# Altium schematic sheet 04_AD623.SchDoc
size A4
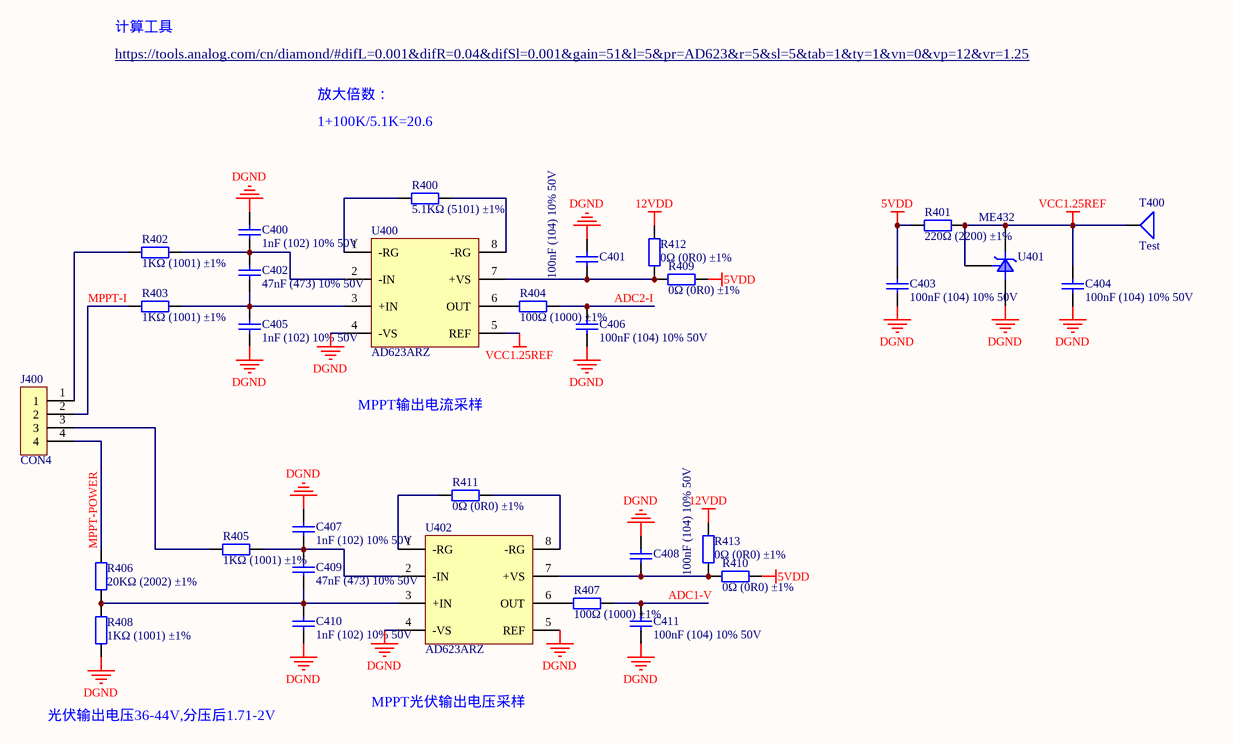
[diagram p0: 04_AD623.SchDoc]

## Parts
C400  1nF (102) 10% 50V  [0603_C]
C401  100nF (104) 10% 50V  [0603_C]
C402  47nF (473) 10% 50V  [0603_C]
C403  100nF (104) 10% 50V  [0603_C]
C404  100nF (104) 10% 50V  [0603_C]
C405  1nF (102) 10% 50V  [0603_C]
C406  100nF (104) 10% 50V  [0603_C]
C407  1nF (102) 10% 50V  [0603_C]
C408  100nF (104) 10% 50V  [0603_C]
C409  47nF (473) 10% 50V  [0603_C]
C410  1nF (102) 10% 50V  [0603_C]
C411  100nF (104) 10% 50V  [0603_C]
J400  CON4  [XH2.54-4P]
R400  5.1KΩ (5101) ±1%  [0603_R]
R401  220Ω (2200) ±1%  [0603_R]
R402  1KΩ (1001) ±1%  [0603_R]
R403  1KΩ (1001) ±1%  [0603_R]
R404  100Ω (1000) ±1%  [0603_R]
R405  1KΩ (1001) ±1%  [0603_R]
R406  20KΩ (2002) ±1%  [0603_R]
R407  100Ω (1000) ±1%  [0603_R]
R408  1KΩ (1001) ±1%  [0603_R]
R409  0Ω (0R0) ±1%  [0603_R]
R410  0Ω (0R0) ±1%  [0603_R]
R411  0Ω (0R0) ±1%  [0603_R]
R412  0Ω (0R0) ±1%  [0603_R]
R413  0Ω (0R0) ±1%  [0603_R]
T400  Test  [Testpoint]
U400  AD623ARZ  [SOIC8]
U401  ME432  [ME432]
U402  AD623ARZ  [SOIC8]

## Nets
5VDD: C403.2 R401.1 R409.2 R410.2
12VDD: R412.2 R413.2
DGND: C400.2 C401.2 C403.1 C404.1 C405.1 C406.1 C407.2 C408.2 C410.1 C411.1 R408.1 U400.4(-VS) U401.2(A) U402.4(-VS) U402.5(REF)
VCC1.25REF: C404.2 R401.2 T400.1 U400.5(REF) U401.1(R) U401.3(K)
ADC1-V: C411.2 R407.2
ADC2-I: C406.2 R404.2
MPPT-I: J400.2 R403.1
MPPT-POWER: J400.4 R406.2
NetC400_1: C400.1 C402.2 R402.2 U400.2(-IN)
NetC401_1: C401.1 R409.1 R412.1 U400.7(+VS)
NetC402_1: C402.1 C405.2 R403.2 U400.3(+IN)
NetC407_1: C407.1 C409.2 R405.2 U402.2(-IN)
NetC408_1: C408.1 R410.1 R413.1 U402.7(+VS)
NetC409_1: C409.1 C410.2 R406.1 R408.2 U402.3(+IN)
NetJ400_1: J400.1 R402.1
NetJ400_3: J400.3 R405.1
NetR400_1: R400.1 U400.1(-RG)
NetR400_2: R400.2 U400.8(-RG)
NetR404_1: R404.1 U400.6(OUT)
NetR407_1: R407.1 U402.6(OUT)
NetR411_1: R411.1 U402.1(-RG)
NetR411_2: R411.2 U402.8(-RG)

## Notes on the sheet
- 计算工具
- https://tools.analog.com/cn/diamond/#difL=0.001&difR=0.04&difSl=0.001&gain=51&l=5&pr=AD623&r=5&sl=5&tab=1&ty=1&vn=0&vp=12&vr=1.25
- 放大倍数：
- 1+100K/5.1K=20.6
- MPPT输出电流采样
- MPPT光伏输出电压采样
- 光伏输出电压36-44V,分压后1.71-2V

## Library data of the parts
C400 C405 C407 C410 = 0603 1nF (102) 10% 50V: 贴片电容; ComponentLink1Description: 供应商链接; ComponentLink1URL: http://www.szlcsc.com/product/details_1940.html; Package: 0603; Supplier: LC; SuppliersPartNumber: C1588
C401 C403 C404 C406 C408 C411 = 0603 100nF (104) 10% 50V: 贴片电容; ComponentLink1Description: 供应商链接; ComponentLink1URL: http://www.szlcsc.com/product/details_15331.html; Package: 0603; Supplier: LC; SuppliersPartNumber: C14663
C402 C409 = 0603 47nF (473) 10% 50V: 贴片电容; ComponentLink1Description: 供应商链接; ComponentLink1URL: http://www.szlcsc.com/product/details_1974.html; Package: 0603; Supplier: LC; SuppliersPartNumber: C1622
R400 = 0603 5.1KΩ (5101) 1%: 贴片电阻; ComponentLink1Description: 供应商链接; ComponentLink1URL: http://www.szlcsc.com/product/details_23913.html; Package: 0603; Supplier: LC; SuppliersPartNumber: C23186
R401 = 0603 220Ω (2200) 1%: 贴片电阻; ComponentLink1Description: 供应商链接; ComponentLink1URL: http://www.szlcsc.com/product/details_23689.html; Package: 0603; Supplier: LC; SuppliersPartNumber: C22962
R402 R403 R405 R408 = 0603 1KΩ (1001) 1%: 贴片电阻; ComponentLink1Description: 供应商链接; ComponentLink1URL: http://www.szlcsc.com/product/details_21904.html; Package: 0603; Supplier: LC; SuppliersPartNumber: C21190
R404 R407 = 0603 100Ω (1000) 1%: 贴片电阻; ComponentLink1Description: 供应商链接; ComponentLink1URL: http://www.szlcsc.com/product/details_23502.html; Package: 0603; Supplier: LC; SuppliersPartNumber: C22775
R406 = 0603 20KΩ (2002) 1%: 贴片电阻; ComponentLink1Description: 供应商链接; ComponentLink1URL: http://www.szlcsc.com/product/details_4591.html; Package: 0603; Supplier: LC; SuppliersPartNumber: C4184
R409-R413 = 0603 0Ω (0R0) 1%: 贴片电阻; ComponentLink1Description: 供应商链接; ComponentLink1URL: http://www.szlcsc.com/product/details_21903.html; Package: 0603; Supplier: LC; SuppliersPartNumber: C21189
T400 = TestPad
U400 U402 = AD623
U401 = CJ431 0.5%431: 电压基准; ComponentLink1Description: 供应商链接; ComponentLink1URL: http://www.szlcsc.com/product/details_3500.html; Package: SOT-23; Supplier: LC; SuppliersPartNumber: C3113